# EAGLE design pcb_v2.3-unrouted (EAGLE 9.1.1)
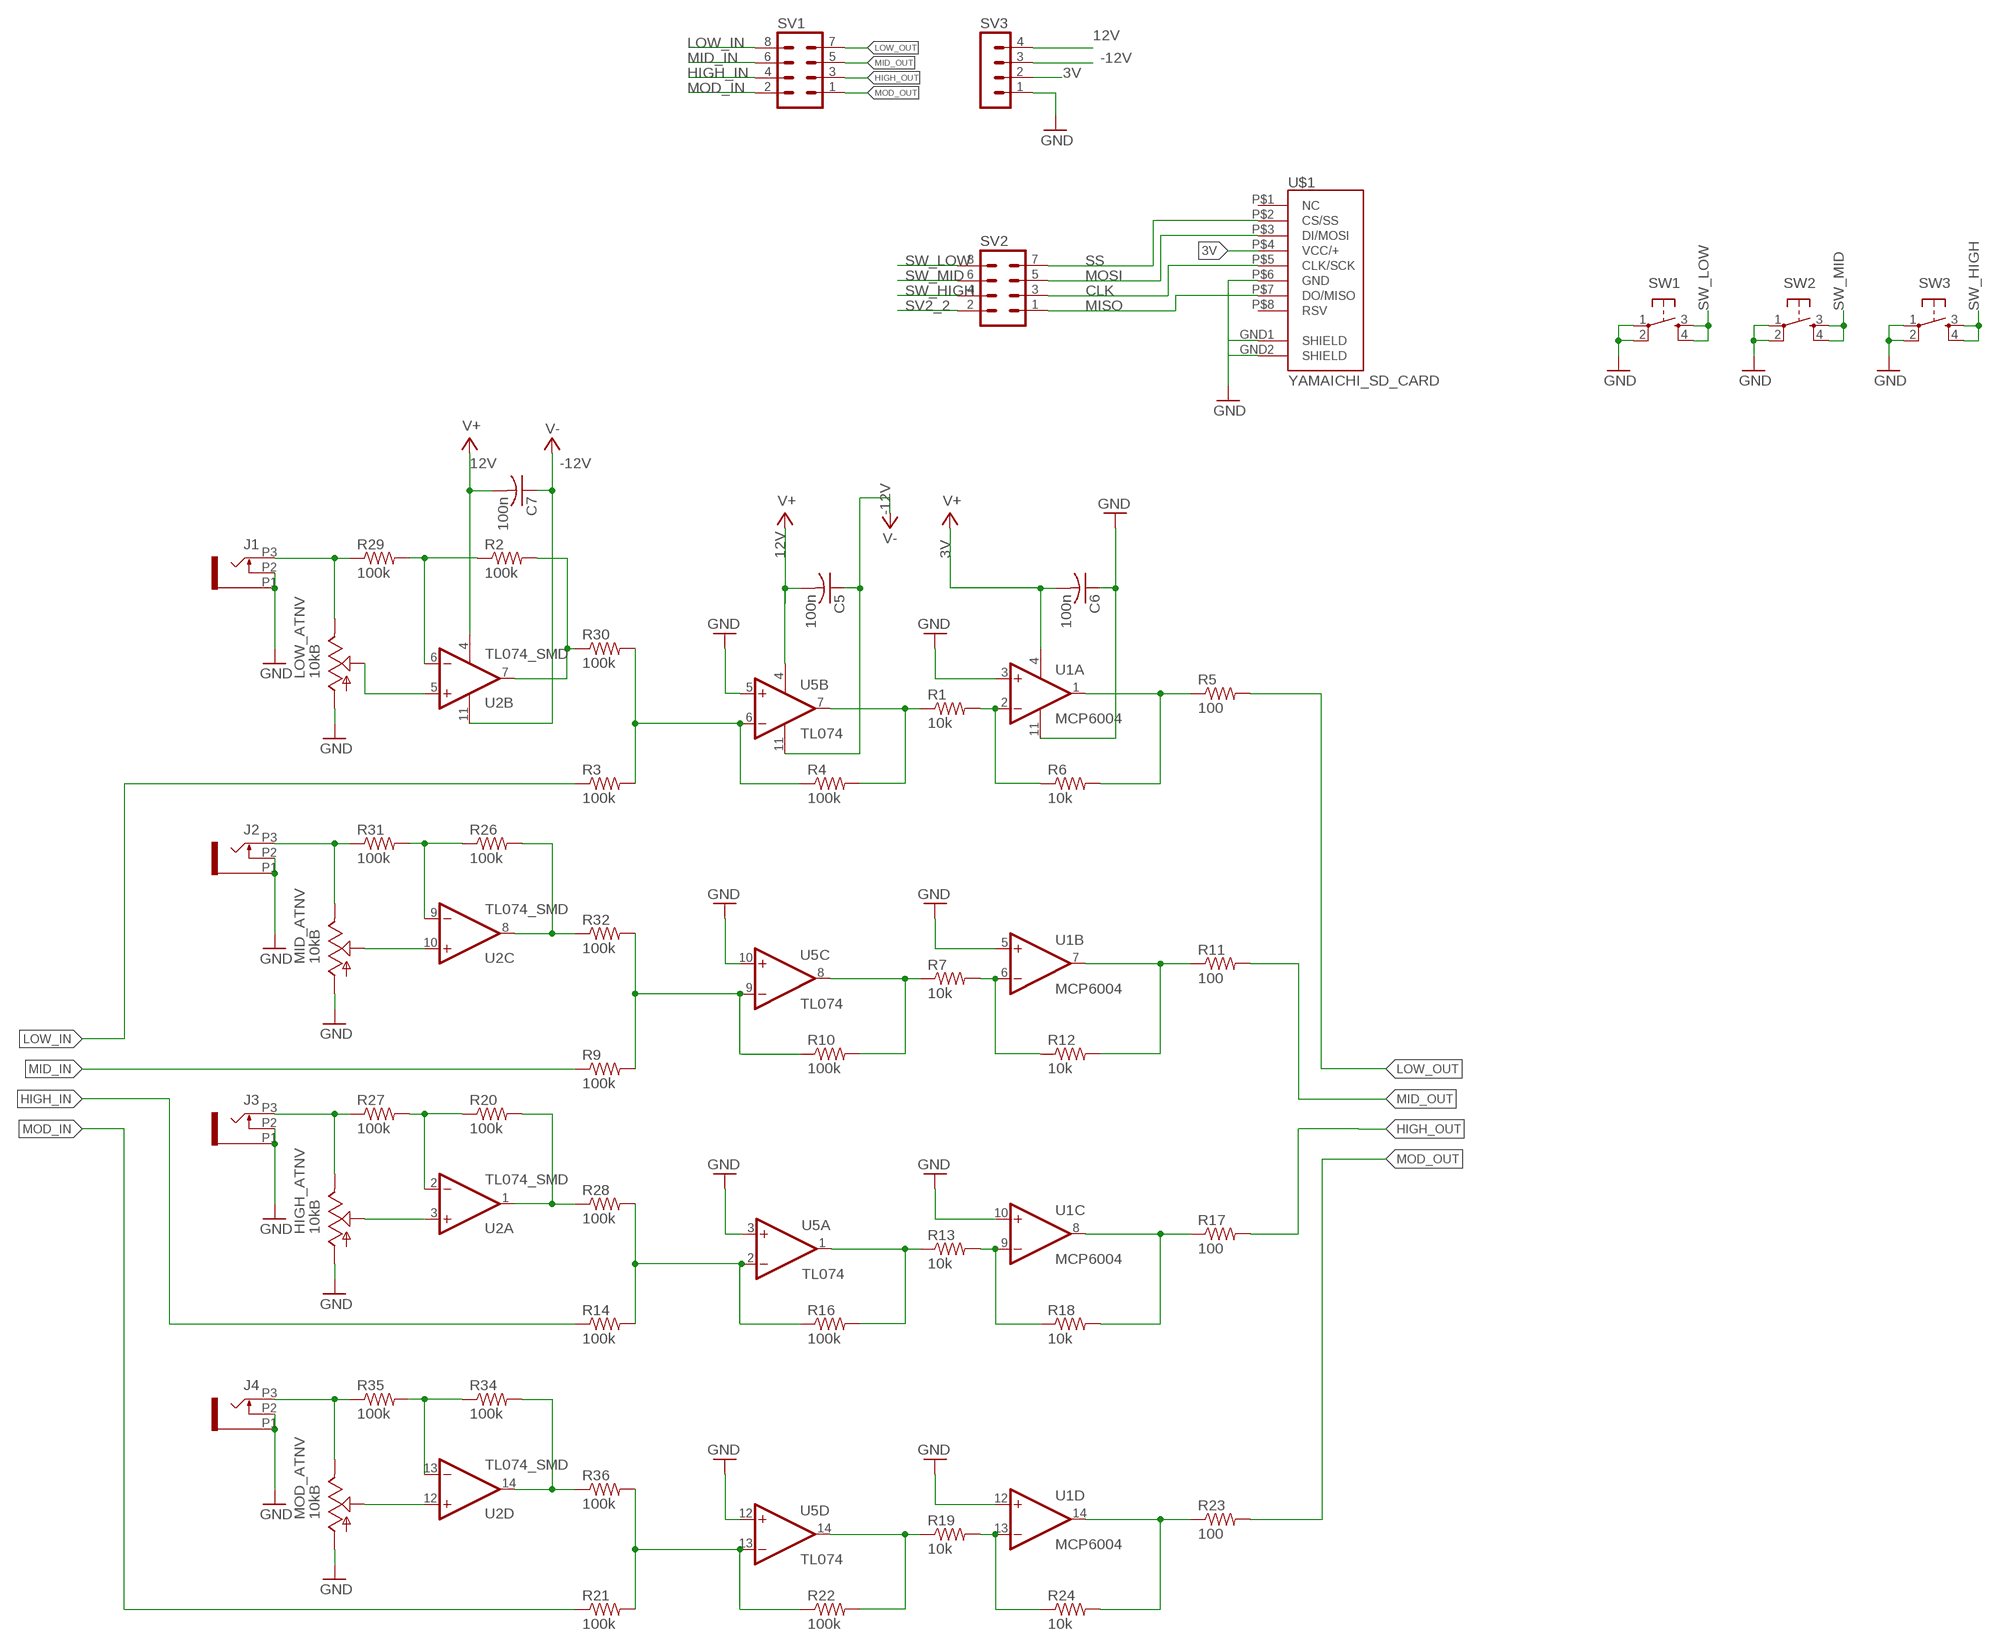
[diagram p0: schematic, sheet 1]

## Parts
C5  100n  C-USC0603  [C0603]
C6  100n  C-USC0603  [C0603]
C7  100n  C-USC0603  [C0603]
HIGH_ATNV  10kB  POT_USVERTICAL  [ALPS_POT_VERTICAL]
J1  PJ301_THONKICONN6  [WQP_PJ_301M6]
J2  PJ301_THONKICONN6  [WQP_PJ_301M6]
J3  PJ301_THONKICONN6  [WQP_PJ_301M6]
J4  PJ301_THONKICONN6  [WQP_PJ_301M6]
LOW_ATNV  10kB  POT_USVERTICAL  [ALPS_POT_VERTICAL]
MID_ATNV  10kB  POT_USVERTICAL  [ALPS_POT_VERTICAL]
MOD_ATNV  10kB  POT_USVERTICAL  [ALPS_POT_VERTICAL]
R1  10k  R-US_R0603  [R0603]
R2  100k  R-US_R0603  [R0603]
R3  100k  R-US_R0603  [R0603]
R4  100k  R-US_R0603  [R0603]
R5  100  R-US_R0603  [R0603]
R6  10k  R-US_R0603  [R0603]
R7  10k  R-US_R0603  [R0603]
R9  100k  R-US_R0603  [R0603]
R10  100k  R-US_R0603  [R0603]
R11  100  R-US_R0603  [R0603]
R12  10k  R-US_R0603  [R0603]
R13  10k  R-US_R0603  [R0603]
R14  100k  R-US_R0603  [R0603]
R16  100k  R-US_R0603  [R0603]
R17  100  R-US_R0603  [R0603]
R18  10k  R-US_R0603  [R0603]
R19  10k  R-US_R0603  [R0603]
R20  100k  R-US_R0603  [R0603]
R21  100k  R-US_R0603  [R0603]
R22  100k  R-US_R0603  [R0603]
R23  100  R-US_R0603  [R0603]
R24  10k  R-US_R0603  [R0603]
R26  100k  R-US_R0603  [R0603]
R27  100k  R-US_R0603  [R0603]
R28  100k  R-US_R0603  [R0603]
R29  100k  R-US_R0603  [R0603]
R30  100k  R-US_R0603  [R0603]
R31  100k  R-US_R0603  [R0603]
R32  100k  R-US_R0603  [R0603]
R34  100k  R-US_R0603  [R0603]
R35  100k  R-US_R0603  [R0603]
R36  100k  R-US_R0603  [R0603]
SV1  MA04-2  [MA04-2]
SV2  MA04-2  [MA04-2]
SV3  MA04-1  [MA04-1]
SW1  TAC_SWITCHPTH  [TACTILE-PTH]
SW2  TAC_SWITCHPTH  [TACTILE-PTH]
SW3  TAC_SWITCHPTH  [TACTILE-PTH]
U1  MCP6004  MCP6004_SMD  [SO14]
U2  TL074_SMD  [SO14]
U5  TL074  TL074_SMD  [SO14]
U$1  YAMAICHI_SD_CARD  [YAMAICHI_MICROSD_VERTICAL]

## Nets
3V: C6.2 SV3.2 U1.4(P:V+) ; supply symbol labelled V+
12V: C5.2 C7.2 SV3.4 U2.4(P:V+) U5.4(P:V+) ; supply symbol labelled V+
-12V: C5.1 C7.1 SV3.3 U2.11(P:V-) U5.11(P:V-) ; supply symbol labelled V-
CLK: SV2.3 U$1.P$5(CLK/SCK)
GND: C6.1 HIGH_ATNV.P$3(A) J1.P1 J1.P2 J2.P1 J2.P2 J3.P1 J3.P2 J4.P1 J4.P2 LOW_ATNV.P$3(A) MID_ATNV.P$3(A) MOD_ATNV.P$3(A) SV3.1 SW1.1 SW1.2 SW2.1 SW2.2 SW3.1 SW3.2 U1.3(A:+IN) U1.5(B:+IN) U1.10(C:+IN) U1.11(P:V-) U1.12(D:+IN) U5.3(A:+IN) U5.5(B:+IN) U5.10(C:+IN) U5.12(D:+IN) U$1.GND1(SHIELD) U$1.GND2(SHIELD) U$1.P$6(GND)
HIGH_ATNV_FDBK: R20.1 R27.2 U2.2(A:-IN)
HIGH_IN: R14.1 SV1.4
HIGH_OUT: R17.2 SV1.3
HIGH_SUM_OUT: R13.1 R16.2 U5.1(A:OUT)
LOW_ATNV_FDBK: R2.1 R29.2 U2.6(B:-IN)
LOW_IN: R3.1 SV1.8
LOW_OUT: R5.2 SV1.7
LOW_SUM_OUT: R1.1 R4.2 U5.7(B:OUT)
MID_ATNV_FDBK: R26.1 R31.2 U2.9(C:-IN)
MID_IN: R9.1 SV1.6
MID_OUT: R11.2 SV1.5
MID_SUM_OUT: R7.1 R10.2 U5.8(C:OUT)
MISO: SV2.1 U$1.P$7(DO/MISO)
MOD_ATNV_FDBK: R34.1 R35.2 U2.13(D:-IN)
MOD_IN: R21.1 SV1.2
MOD_OUT: R23.2 SV1.1
MOD_SUM_OUT: R19.1 R22.2 U5.14(D:OUT)
MOSI: SV2.5 U$1.P$3(DI/MOSI)
N$1: MID_ATNV.P$2(S) U2.10(C:+IN)
N$2: R1.2 R6.1 U1.2(A:-IN)
N$3: R2.2 R30.1 U2.7(B:OUT)
N$4: LOW_ATNV.P$2(S) U2.5(B:+IN)
N$5: R5.1 R6.2 U1.1(A:OUT)
N$6: R3.2 R4.1 R30.2 U5.6(B:-IN)
N$7: HIGH_ATNV.P$2(S) U2.3(A:+IN)
N$8: R9.2 R10.1 R32.2 U5.9(C:-IN)
N$9: R7.2 R12.1 U1.6(B:-IN)
N$12: HIGH_ATNV.P$1(E) J3.P3 R27.1
N$13: R20.2 R28.1 U2.1(A:OUT)
N$16: U$1.P$4(VCC/+)
N$23: R13.2 R18.1 U1.9(C:-IN)
N$24: R19.2 R24.1 U1.13(D:-IN)
N$26: R11.1 R12.2 U1.7(B:OUT)
N$27: R17.1 R18.2 U1.8(C:OUT)
N$28: R23.1 R24.2 U1.14(D:OUT)
N$30: J1.P3 LOW_ATNV.P$1(E) R29.1
N$32: J2.P3 MID_ATNV.P$1(E) R31.1
N$33: R26.2 R32.1 U2.8(C:OUT)
N$34: MOD_ATNV.P$2(S) U2.12(D:+IN)
N$35: J4.P3 MOD_ATNV.P$1(E) R35.1
N$36: R34.2 R36.1 U2.14(D:OUT)
N$37: R14.2 R16.1 R28.2 U5.2(A:-IN)
N$38: R21.2 R22.1 R36.2 U5.13(D:-IN)
SS: SV2.7 U$1.P$2(CS/SS)
SV2_2: SV2.2
SW_HIGH: SV2.4 SW3.3 SW3.4
SW_LOW: SV2.8 SW1.3 SW1.4
SW_MID: SV2.6 SW2.3 SW2.4
Unconnected: U$1.P$1(NC) U$1.P$8(RSV)

## Library data of the parts
C5-C7 = rcl:C-US: CAPACITOR, American symbol; SPICEPREFIX: C
HIGH_ATNV LOW_ATNV MID_ATNV MOD_ATNV = og-pots:POT_US
J1-J4 = og-pj301:PJ301_THONKICONN; SPICEPREFIX: J
R1-R7 R9-R14 R16-R24 R26-R32 R34-R36 = rcl:R-US_: RESISTOR, American symbol; SPICEPREFIX: R
SV1 SV2 = con-lstb:MA04-2: PIN HEADER; OC_FARNELL: unknown; OC_NEWARK: unknown
SV3 = con-lstb:MA04-1: PIN HEADER; OC_FARNELL: unknown; OC_NEWARK: unknown
SW1-SW3 = SparkFun:TAC_SWITCH: Momentary Switch Button commonly used for reset or general input. Spark Fun Electronics SKU : COM-00097
U1 = MusicThingModular:MCP6004: Generic Quad Op Amp
U2 U5 = MusicThingModular:TL074: Generic Quad Op Amp
U$1 = MusicThingModular:YAMAICHI_SD_CARD: Vertical SD Card Holder

## Board
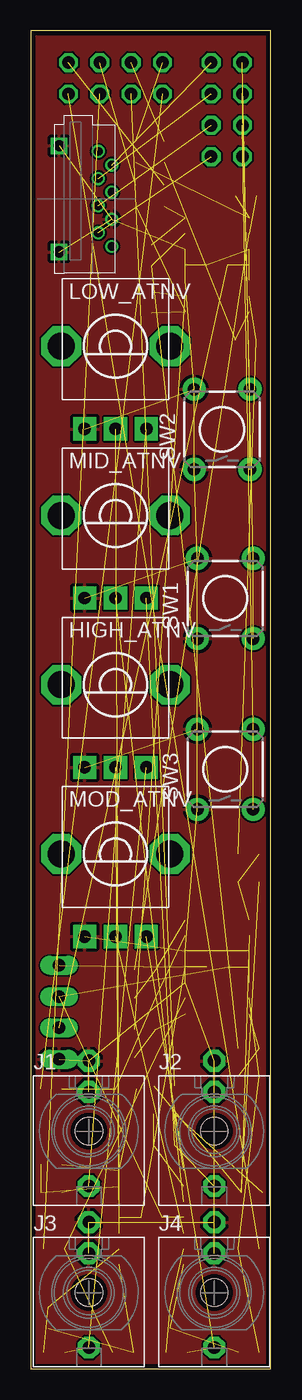
[diagram p1: board, top side]
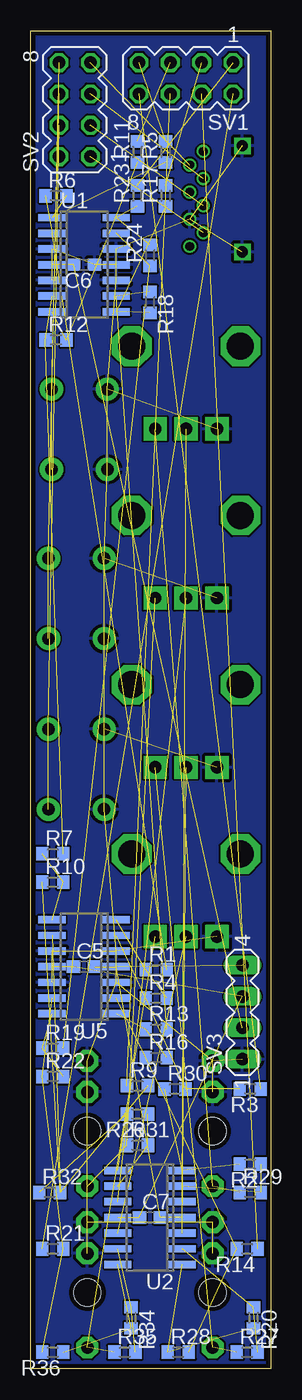
[diagram p2: board, bottom side, seen from below]

Size 19.43 x 108.43 mm. Coordinates in mm from the lower left corner, seen from the top.
Outline: 0,0 19.43,0 19.43,108.43 0,108.43 0,0
Copper layers (1*16): Top 0.035559375mm / dielectric 1.6mm / Bottom 0.035559375mm
Design rules "oshpark-2layer": minimum track width 6mil, minimum drill 10mil, track to track 6mil, track to pad 6mil, pad to pad 6mil, via to via 6mil, smd to smd 6mil, copper to edge 15mil, drill to drill 6mil, minimum pad ring 5mil, minimum via ring 5mil, stop-mask expansion 2.5mil, vias tented up to drill 0mil, thermal gap 10mil

### Footprints (pad centres in the part's own frame; a part is rotated, then mirrored left to right if it is on the bottom)
C0603 = smd 1.1 x 1: 1 -0.85,0; 2 0.85,0
ALPS_POT_VERTICAL = drill 1 pad 1.88 square: P$1 -2.5,6.7; P$2 0,6.7; P$3 2.5,6.7 | drill 2.2 pad 3.175 octagon: P$4 -4.4,0; P$5 4.4,0
WQP_PJ_301M6 = drill 1.016 pad 1.778 octagon: P1 0,-5.715; P2 0,-3.175; P3 0,4.445 | hole 2.2: 0,0
R0603 = smd 1 x 1.1: 1 -0.85,0; 2 0.85,0
MA04-2 = drill 1.016 octagon: 1 -3.81,-1.27; 2 -3.81,1.27; 3 -1.27,-1.27; 4 -1.27,1.27; 5 1.27,-1.27; 6 1.27,1.27; 7 3.81,-1.27; 8 3.81,1.27
MA04-1 = drill 1.016 long: 1 -3.81,0; 2 -1.27,0; 3 1.27,0; 4 3.81,0
TACTILE-PTH = drill 1.016 pad 1.88: 1 -3.251,2.261; 2 3.251,2.261; 3 -3.251,-2.261; 4 3.251,-2.261
SO14 = smd 0.6 x 2.2: 1 -3.81,-2.6; 2 -2.54,-2.6; 3 -1.27,-2.6; 4 0,-2.6; 5 1.27,-2.6; 6 2.54,-2.6; 7 3.81,-2.6; 8 3.81,2.6; 9 2.54,2.6; 10 1.27,2.6; 11 0,2.6; 12 -1.27,2.6; 13 -2.54,2.6; 14 -3.81,2.6
YAMAICHI_MICROSD_VERTICAL = drill 0.9 square: GND1 -4.3,-3.17; GND2 4.3,-3.17 | drill 0.7: P$1 -3.85,0; P$2 -2.75,1.1; P$3 -1.65,0; P$4 -0.55,1.1; P$5 0.55,0; P$6 1.65,1.1; P$7 2.75,0; P$8 3.85,1.1

### Placement (x,y rotation side)
C5  15.11,32.58 0 bottom
C6  15.11,89.47 180 bottom
C7  9.78,12.26 0 bottom
HIGH_ATNV  6.86,55.44 180 top
J1  4.7,19.24 180 top
J2  14.86,19.24 180 top
J3  4.7,6.16 180 top
J4  14.86,6.16 180 top
LOW_ATNV  6.86,82.87 180 top
MID_ATNV  6.86,69.15 180 top
MOD_ATNV  6.86,41.72 180 top
R1  9.27,32.32 0 bottom
R2  1.65,16.57 180 bottom
R3  1.65,22.67 180 bottom
R4  9.27,30.04 0 bottom
R5  8.51,98.62 90 bottom
R6  17.4,95.06 0 bottom
R7  17.65,41.72 0 bottom
R9  10.79,22.92 0 bottom
R10  17.65,39.43 0 bottom
R11  10.79,98.62 90 bottom
R12  17.4,83.38 0 bottom
R13  9.27,27.5 0 bottom
R14  1.91,9.72 180 bottom
R16  9.27,25.21 0 bottom
R17  8.51,95.06 90 bottom
R18  9.78,86.42 270 bottom
R19  17.65,25.97 0 bottom
R20  1.4,4.13 270 bottom
R21  17.65,9.72 0 bottom
R22  17.65,23.69 0 bottom
R23  10.79,95.06 90 bottom
R24  9.78,90.23 90 bottom
R26  10.79,20.64 180 bottom
R27  1.91,1.33 0 bottom
R28  7.49,1.33 0 bottom
R29  1.65,14.29 0 bottom
R30  7.75,22.67 0 bottom
R31  10.79,18.1 0 bottom
R32  17.91,14.29 0 bottom
R34  11.3,4.13 270 bottom
R35  11.81,1.33 0 bottom
R36  17.65,1.33 180 bottom
SV1  6.86,104.58 180 bottom
SV2  15.88,102.04 90 bottom
SV3  2.29,28.89 90 bottom
SW1  15.75,62.42 90 top
SW2  15.49,76.14 90 top
SW3  15.75,48.58 90 top
U1  15.11,89.47 270 bottom
U2  9.78,12.26 90 bottom
U5  15.11,32.58 90 bottom
U$1  5.46,94.81 270 top

### Tracks (layer width: path | path; a pad name or v marks a point on that pad's centre or on a via)
3V  (2 unrouted)
12V  (4 unrouted)
-12V  (4 unrouted)
CLK  (1 unrouted)
GND  (31 unrouted)
  pour Bottom: -0.13,108.52 19.68,108.52 19.68,-0.7 0.38,-0.7 -0.13,-0.19
  pour Top: -0.64,109.03 20.19,109.03 20.19,-0.7 19.68,-1.21 0.38,-1.21 -0.64,-0.19
HIGH_ATNV_FDBK  (2 unrouted)
HIGH_IN  (1 unrouted)
HIGH_OUT  (1 unrouted)
HIGH_SUM_OUT  (2 unrouted)
LOW_ATNV_FDBK  (2 unrouted)
LOW_IN  (1 unrouted)
LOW_OUT  (1 unrouted)
LOW_SUM_OUT  (2 unrouted)
MID_ATNV_FDBK  (2 unrouted)
MID_IN  (1 unrouted)
MID_OUT  (1 unrouted)
MID_SUM_OUT  (2 unrouted)
MISO  (1 unrouted)
MOD_ATNV_FDBK  (2 unrouted)
MOD_IN  (1 unrouted)
MOD_OUT  (1 unrouted)
MOD_SUM_OUT  (2 unrouted)
MOSI  (1 unrouted)
N$1  (1 unrouted)
N$2  (2 unrouted)
N$3  (2 unrouted)
N$4  (1 unrouted)
N$5  (2 unrouted)
N$6  (3 unrouted)
N$7  (1 unrouted)
N$8  (3 unrouted)
N$9  (2 unrouted)
N$12  (2 unrouted)
N$13  (2 unrouted)
N$23  (2 unrouted)
N$24  (2 unrouted)
N$26  (2 unrouted)
N$27  (2 unrouted)
N$28  (2 unrouted)
N$30  (2 unrouted)
N$32  (2 unrouted)
N$33  (2 unrouted)
N$34  (1 unrouted)
N$35  (2 unrouted)
N$36  (2 unrouted)
N$37  (3 unrouted)
N$38  (3 unrouted)
SS  (1 unrouted)
SW_HIGH  (2 unrouted)
SW_LOW  (2 unrouted)
SW_MID  (2 unrouted)